# Altium schematic sheet Принципиальная схема.SchDoc: Плата коммутации
size 420 x 297 mm; CompanyName: Университет ИТМО; SheetNumber: 1; SheetTotal: 1; PageSetup: Record=PageOptions|CenterHorizontal=True|CenterVertical=True|PrintScale=0.94|XCorrection=1.00|YCorrection=1.00|PrintKind=1|BorderSize=5000000|LeftOffset=0|BottomOffset=0|Orientation=1|PaperLength=1000|PaperWidth=1000|Scale=100|PaperSource=7|PrintQuality=-4|MediaType=1|DitherType=10|PaperKind=A4|PrintScaleMode=1; DecimalNumber: XXXX.758756.001; Name1: Плата коммутации; DocumentName: Sheet1.SCHDOC
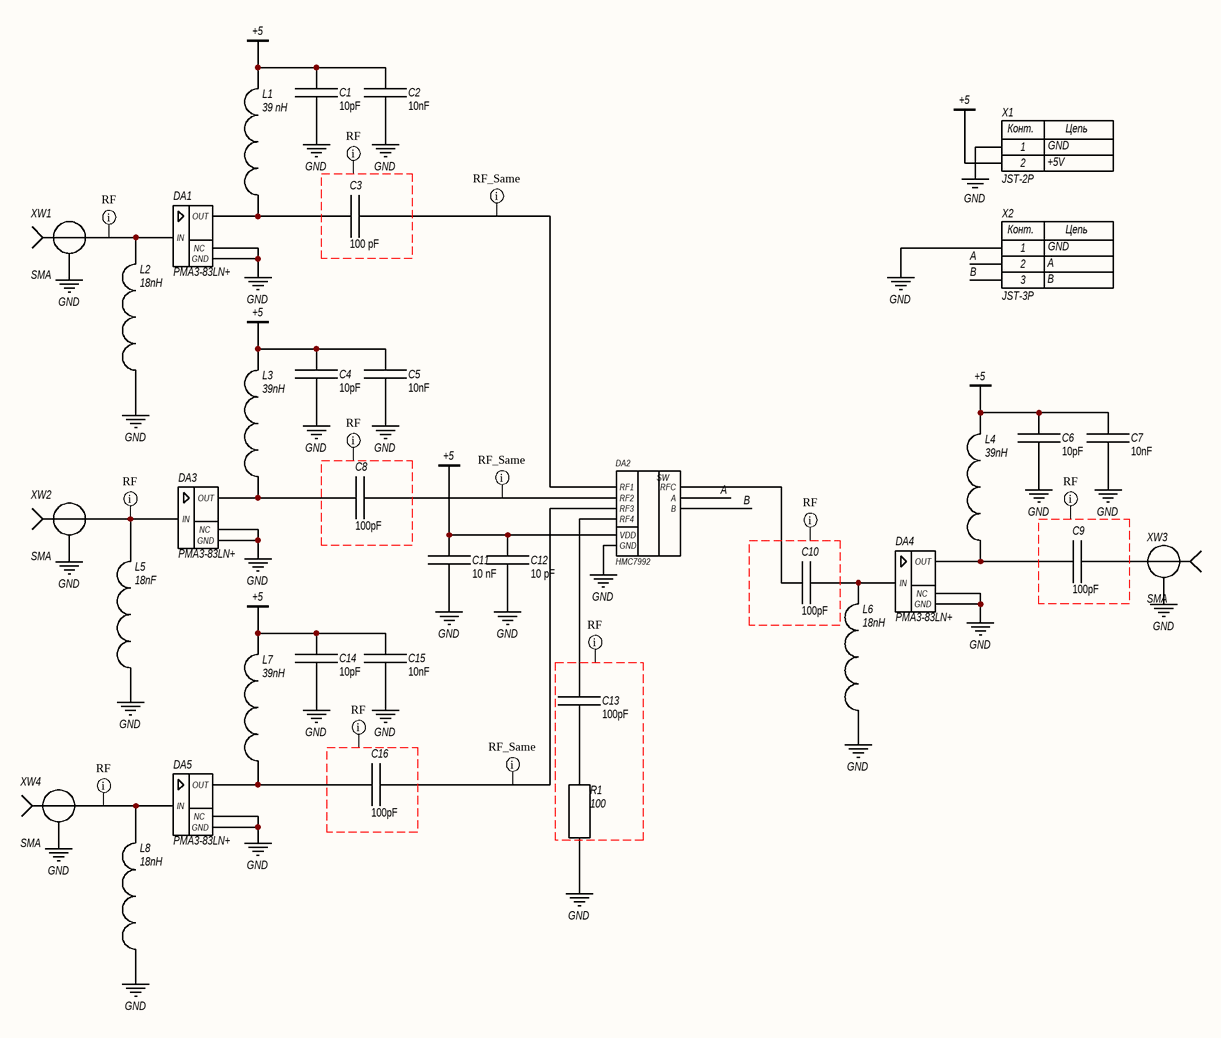
[diagram p0: Принципиальная схема.SchDoc]

## Parts
C1  10pF  [FP-GJM155-0_05-IPC_A]
C2  10nF  [FP-GJM155-0_05-IPC_A]
C3  100 pF  [FP-GJM155-0_05-IPC_A]
C4  10pF  [FP-GJM155-0_05-IPC_A]
C5  10nF  [FP-GJM155-0_05-IPC_A]
C6  10pF  [FP-GJM155-0_05-IPC_A]
C7  10nF  [FP-GJM155-0_05-IPC_A]
C8  100pF  [FP-GJM155-0_05-IPC_A]
C9  100pF  [FP-GJM155-0_05-IPC_A]
C10  100pF  [FP-GJM155-0_05-IPC_A]
C11  10 nF  [FP-GJM155-0_05-IPC_A]
C12  10 pF  [FP-GJM155-0_05-IPC_A]
C13  100pF  [FP-GJM155-0_05-IPC_A]
C14  10pF  [FP-GJM155-0_05-IPC_A]
C15  10nF  [FP-GJM155-0_05-IPC_A]
C16  100pF  [FP-GJM155-0_05-IPC_A]
DA1  PMA3-83LN+  [FP-DQ1225-IPC_A]
DA2  HMC7992  [FP-CP-16-38-IPC_A]
DA3  PMA3-83LN+  [FP-DQ1225-IPC_A]
DA4  PMA3-83LN+  [FP-DQ1225-IPC_A]
DA5  PMA3-83LN+  [FP-DQ1225-IPC_A]
L1  39 nH  [FP-0402HP-MFG]
L2  18nH  [FP-0402HP-MFG]
L3  39nH  [FP-0402HP-MFG]
L4  39nH  [FP-0402HP-MFG]
L5  18nF  [FP-0402HP-MFG]
L6  18nH  [FP-0402HP-MFG]
L7  39nH  [FP-0402HP-MFG]
L8  18nH  [FP-0402HP-MFG]
R1  100  [FP-CR0402-IPC_A]
X1  JST-2P  [FP-S2B-XH-A-1_LF_SN-MFG]
X2  JST-3P  [FP-S3B-XH-A-1_LF_SN-MFG]
XW1  SMA  [S-P2152-19CQA]
XW2  SMA  [S-P2152-19CQA]
XW3  SMA  [S-P2152-19CQA]
XW4  SMA  [S-P2152-19CQA]

## Nets
+5: C1.1 C2.1 C4.1 C5.1 C6.1 C7.1 C11.2 C12.2 C14.1 C15.1 DA2.6(VDD) L1.2 L3.2 L4.2 L7.2 X1.2
GND: C1.2 C2.2 C4.2 C5.2 C6.2 C7.2 C11.1 C12.1 C14.2 C15.2 DA1.1,3,4,5,6,7,9,10(NC) DA1.13(GND) DA2.2,_3,_5,_10,_11,_13,_14,_16,_17(GND) DA3.1,3,4,5,6,7,9,10(NC) DA3.13(GND) DA4.1,3,4,5,6,7,9,10(NC) DA4.13(GND) DA5.1,3,4,5,6,7,9,10(NC) DA5.13(GND) L2.1 L5.1 L6.1 L8.1 R1.1 X1.1 X2.1 XW1.2 XW2.2 XW3.2 XW4.2
A: DA2.8(A) X2.2
B: DA2.7(B) X2.3
NetC3_1: C3.1 DA2.12(RF1)
NetC3_2: C3.2 DA1.8(OUT) L1.1
NetC8_1: C8.1 DA2.9(RF2)
NetC8_2: C8.2 DA3.8(OUT) L3.1
NetC9_1: C9.1 XW3.1
NetC9_2: C9.2 DA4.8(OUT) L4.1
NetC10_1: C10.1 DA4.2(IN) L6.2
NetC10_2: C10.2 DA2.15(RFC)
NetC13_1: C13.1 R1.2
NetC13_2: C13.2 DA2.1(RF4)
NetC16_1: C16.1 DA2.4(RF3)
NetC16_2: C16.2 DA5.8(OUT) L7.1
NetDA1_2: DA1.2(IN) L2.2 XW1.1
NetDA3_2: DA3.2(IN) L5.2 XW2.1
NetDA5_2: DA5.2(IN) L8.2 XW4.1

## Layout directives
net class RF: (no net found under the mark), NetDA1_2, NetDA3_2, NetDA5_2
net class RF_SAME: NetC3_1, NetC8_1, NetC16_1

## Notes on the sheet
- Перв.примен.
- Справ.№
- Подп. и дата
- Инв.№ дубл.
- Взам.инв.№
- Подп.и дата
- Разраб.
- Изм.
- Лист
- № докум.
- Подп.
- Дата
- Лит.
- Масштаб
- Масса
- Т.контр.
- Пров.
- СХЕМА   ЭЛЕКТРИЧЕСКАЯ
- ПРИНЦИПИАЛЬНАЯ
- Листов
- Инв.№ подл.
- Утв.
- Н.контр.
- Нач.сект.
- Формат  A3
- (in symbol HMC7992) SW
- (in symbol JST-2P) Конт.; Цепь
- (in symbol JST-3P) Конт.; Цепь

## Library data of the parts
C1-C16 = C
L1-L8 = L
R1 = R
X1 = JST-2P: JST type connector; Net1: GND; Net2: +5V
X2 = JST-3P: JST type connector; Net1: GND; Net2: A; Net3: B
DA1 DA3-DA5 = PMA3-83LN+
  DA1: ClassName: AMP1
  DA3: ClassName: AMP2
  DA4: ClassName: AMP4
  DA5: ClassName: AMP3
XW1-XW4 = SMA
  XW1: ClassName: AMP1
  XW2: ClassName: AMP2
  XW3: ClassName: AMP4
  XW4: ClassName: AMP3